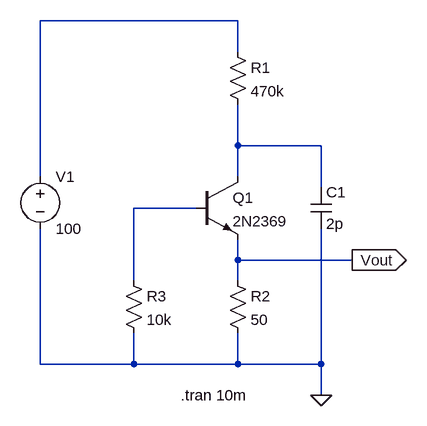
[diagram p0: schematic trans_avalanche.asc]
trans_avalanche.asc, the LTspice schematic file:
Version 4
SHEET 1 1400 1076
WIRE 128 -256 -176 -256
WIRE 128 -208 128 -256
WIRE 128 -64 128 -128
WIRE 256 -64 128 -64
WIRE -176 -16 -176 -256
WIRE 128 -16 128 -64
WIRE 256 0 256 -64
WIRE 64 32 -32 32
WIRE 128 112 128 80
WIRE 304 112 128 112
WIRE -32 144 -32 32
WIRE 128 144 128 112
WIRE -176 272 -176 64
WIRE -32 272 -32 224
WIRE -32 272 -176 272
WIRE 128 272 128 224
WIRE 128 272 -32 272
WIRE 256 272 256 64
WIRE 256 272 128 272
WIRE 256 320 256 272
FLAG 304 112 Vout
IOPIN 304 112 Out
FLAG 256 320 0
SYMBOL npn 64 -16 R0
SYMATTR InstName Q1
SYMATTR Value 2N2369
SYMBOL res 112 -224 R0
SYMATTR InstName R1
SYMATTR Value 470k
SYMBOL voltage -176 -32 R0
WINDOW 123 0 0 Left 0
WINDOW 39 0 0 Left 0
SYMATTR InstName V1
SYMATTR Value 100
SYMBOL res 112 128 R0
SYMATTR InstName R2
SYMATTR Value 50
SYMBOL res -48 128 R0
SYMATTR InstName R3
SYMATTR Value 10k
SYMBOL cap 240 0 R0
SYMATTR InstName C1
SYMATTR Value 2p
TEXT 40 320 Left 2 !.tran 10m

The netlist it stands for:
* trans_avalanche.asc
Q1 N002 N003 Vout 0 2N2369
R1 N001 N002 470k
V1 N001 0 100
R2 Vout 0 50
R3 N003 0 10k
C1 N002 0 2p
.model NPN NPN
.model PNP PNP
.lib standard.bjt
.tran 10m
.backanno
.end